# Altium schematic sheet thermocouple_2.SchDoc
size B; Address1: MILWAUKEE TOOL; Address2: 13135 W. Lisbon Rd.; Address3: Brookfield, WI 53005; SheetNumber: 1; SheetTotal: 1
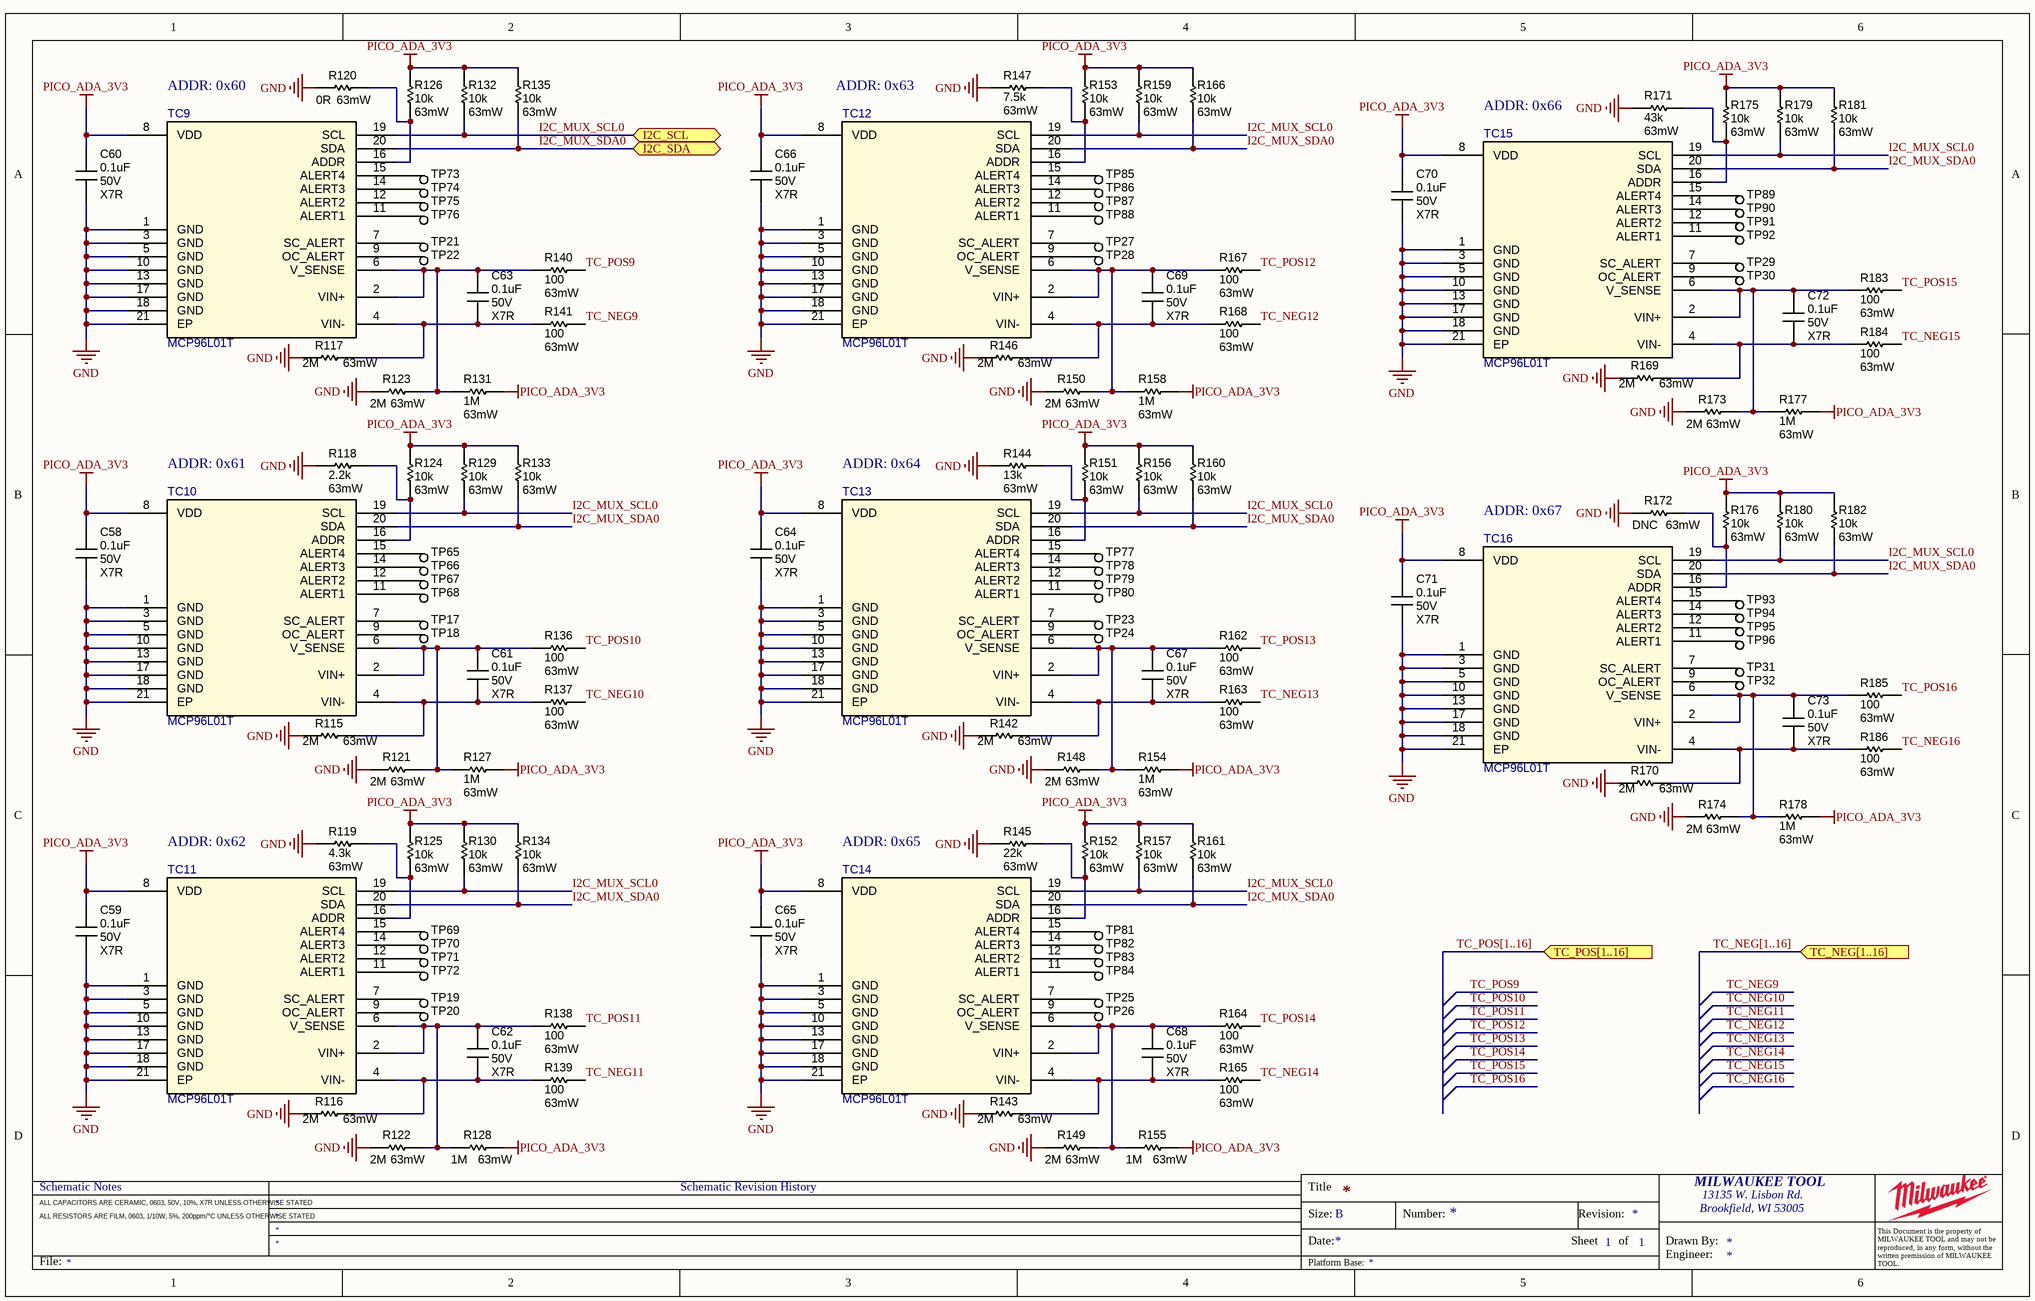
[diagram p0: thermocouple_2.SchDoc]

## Parts
C58  0.1uF  Voltage Rating: 50V  Temp Coeff: X7R  [CAPC1608X09N]
C59  0.1uF  Voltage Rating: 50V  Temp Coeff: X7R  [CAPC1608X09N]
C60  0.1uF  Voltage Rating: 50V  Temp Coeff: X7R  [CAPC1608X09N]
C61  0.1uF  Voltage Rating: 50V  Temp Coeff: X7R  [CAPC1005X06N]
C62  0.1uF  Voltage Rating: 50V  Temp Coeff: X7R  [CAPC1005X06N]
C63  0.1uF  Voltage Rating: 50V  Temp Coeff: X7R  [CAPC1005X06N]
C64  0.1uF  Voltage Rating: 50V  Temp Coeff: X7R  [CAPC1608X09N]
C65  0.1uF  Voltage Rating: 50V  Temp Coeff: X7R  [CAPC1608X09N]
C66  0.1uF  Voltage Rating: 50V  Temp Coeff: X7R  [CAPC1608X09N]
C67  0.1uF  Voltage Rating: 50V  Temp Coeff: X7R  [CAPC1005X06N]
C68  0.1uF  Voltage Rating: 50V  Temp Coeff: X7R  [CAPC1005X06N]
C69  0.1uF  Voltage Rating: 50V  Temp Coeff: X7R  [CAPC1005X06N]
C70  0.1uF  Voltage Rating: 50V  Temp Coeff: X7R  [CAPC1608X09N]
C71  0.1uF  Voltage Rating: 50V  Temp Coeff: X7R  [CAPC1608X09N]
C72  0.1uF  Voltage Rating: 50V  Temp Coeff: X7R  [CAPC1005X06N]
C73  0.1uF  Voltage Rating: 50V  Temp Coeff: X7R  [CAPC1005X06N]
R115  2M  Wattage: 63mW  [RESC1005X04N]
R116  2M  Wattage: 63mW  [RESC1005X04N]
R117  2M  Wattage: 63mW  [RESC1005X04N]
R118  2.2k  Wattage: 63mW  [RESC1005X04N]
R119  4.3k  Wattage: 63mW  [RESC1005X04N]
R120  0R  Wattage: 63mW  [RESC1005X04N]
R121  2M  Wattage: 63mW  [RESC1005X04N]
R122  2M  Wattage: 63mW  [RESC1005X04N]
R123  2M  Wattage: 63mW  [RESC1005X04N]
R124  10k  Wattage: 63mW  [RESC1005X04N]
R125  10k  Wattage: 63mW  [RESC1005X04N]
R126  10k  Wattage: 63mW  [RESC1005X04N]
R127  1M  Wattage: 63mW  [RESC1005X04N]
R128  1M  Wattage: 63mW  [RESC1005X04N]
R129  10k  Wattage: 63mW  [RESC1005X04N]
R130  10k  Wattage: 63mW  [RESC1005X04N]
R131  1M  Wattage: 63mW  [RESC1005X04N]
R132  10k  Wattage: 63mW  [RESC1005X04N]
R133  10k  Wattage: 63mW  [RESC1005X04N]
R134  10k  Wattage: 63mW  [RESC1005X04N]
R135  10k  Wattage: 63mW  [RESC1005X04N]
R136  100  Wattage: 63mW  [RESC1005X04N]
R137  100  Wattage: 63mW  [RESC1005X04N]
R138  100  Wattage: 63mW  [RESC1005X04N]
R139  100  Wattage: 63mW  [RESC1005X04N]
R140  100  Wattage: 63mW  [RESC1005X04N]
R141  100  Wattage: 63mW  [RESC1005X04N]
R142  2M  Wattage: 63mW  [RESC1005X04N]
R143  2M  Wattage: 63mW  [RESC1005X04N]
R144  13k  Wattage: 63mW  [RESC1005X04N]
R145  22k  Wattage: 63mW  [RESC1005X04N]
R146  2M  Wattage: 63mW  [RESC1005X04N]
R147  7.5k  Wattage: 63mW  [RESC1005X04N]
R148  2M  Wattage: 63mW  [RESC1005X04N]
R149  2M  Wattage: 63mW  [RESC1005X04N]
R150  2M  Wattage: 63mW  [RESC1005X04N]
R151  10k  Wattage: 63mW  [RESC1005X04N]
R152  10k  Wattage: 63mW  [RESC1005X04N]
R153  10k  Wattage: 63mW  [RESC1005X04N]
R154  1M  Wattage: 63mW  [RESC1005X04N]
R155  1M  Wattage: 63mW  [RESC1005X04N]
R156  10k  Wattage: 63mW  [RESC1005X04N]
R157  10k  Wattage: 63mW  [RESC1005X04N]
R158  1M  Wattage: 63mW  [RESC1005X04N]
R159  10k  Wattage: 63mW  [RESC1005X04N]
R160  10k  Wattage: 63mW  [RESC1005X04N]
R161  10k  Wattage: 63mW  [RESC1005X04N]
R162  100  Wattage: 63mW  [RESC1005X04N]
R163  100  Wattage: 63mW  [RESC1005X04N]
R164  100  Wattage: 63mW  [RESC1005X04N]
R165  100  Wattage: 63mW  [RESC1005X04N]
R166  10k  Wattage: 63mW  [RESC1005X04N]
R167  100  Wattage: 63mW  [RESC1005X04N]
R168  100  Wattage: 63mW  [RESC1005X04N]
R169  2M  Wattage: 63mW  [RESC1005X04N]
R170  2M  Wattage: 63mW  [RESC1005X04N]
R171  43k  Wattage: 63mW  [RESC1005X04N]
R172  DNC  Wattage: 63mW  [RESC1005X04N]
R173  2M  Wattage: 63mW  [RESC1005X04N]
R174  2M  Wattage: 63mW  [RESC1005X04N]
R175  10k  Wattage: 63mW  [RESC1005X04N]
R176  10k  Wattage: 63mW  [RESC1005X04N]
R177  1M  Wattage: 63mW  [RESC1005X04N]
R178  1M  Wattage: 63mW  [RESC1005X04N]
R179  10k  Wattage: 63mW  [RESC1005X04N]
R180  10k  Wattage: 63mW  [RESC1005X04N]
R181  10k  Wattage: 63mW  [RESC1005X04N]
R182  10k  Wattage: 63mW  [RESC1005X04N]
R183  100  Wattage: 63mW  [RESC1005X04N]
R184  100  Wattage: 63mW  [RESC1005X04N]
R185  100  Wattage: 63mW  [RESC1005X04N]
R186  100  Wattage: 63mW  [RESC1005X04N]
TC9  MCP96L01T  [QFN65P500X500X100_HS-21N]
TC10  MCP96L01T  [QFN65P500X500X100_HS-21N]
TC11  MCP96L01T  [QFN65P500X500X100_HS-21N]
TC12  MCP96L01T  [QFN65P500X500X100_HS-21N]
TC13  MCP96L01T  [QFN65P500X500X100_HS-21N]
TC14  MCP96L01T  [QFN65P500X500X100_HS-21N]
TC15  MCP96L01T  [QFN65P500X500X100_HS-21N]
TC16  MCP96L01T  [QFN65P500X500X100_HS-21N]
TP17  TP_SMT_1MM_CIR  [TP_SMT_1.0MM_CIR]  (value not drawn)  (no BOM)
TP18  TP_SMT_1MM_CIR  [TP_SMT_1.0MM_CIR]  (value not drawn)  (no BOM)
TP19  TP_SMT_1MM_CIR  [TP_SMT_1.0MM_CIR]  (value not drawn)  (no BOM)
TP20  TP_SMT_1MM_CIR  [TP_SMT_1.0MM_CIR]  (value not drawn)  (no BOM)
TP21  TP_SMT_1MM_CIR  [TP_SMT_1.0MM_CIR]  (value not drawn)  (no BOM)
TP22  TP_SMT_1MM_CIR  [TP_SMT_1.0MM_CIR]  (value not drawn)  (no BOM)
TP23  TP_SMT_1MM_CIR  [TP_SMT_1.0MM_CIR]  (value not drawn)  (no BOM)
TP24  TP_SMT_1MM_CIR  [TP_SMT_1.0MM_CIR]  (value not drawn)  (no BOM)
TP25  TP_SMT_1MM_CIR  [TP_SMT_1.0MM_CIR]  (value not drawn)  (no BOM)
TP26  TP_SMT_1MM_CIR  [TP_SMT_1.0MM_CIR]  (value not drawn)  (no BOM)
TP27  TP_SMT_1MM_CIR  [TP_SMT_1.0MM_CIR]  (value not drawn)  (no BOM)
TP28  TP_SMT_1MM_CIR  [TP_SMT_1.0MM_CIR]  (value not drawn)  (no BOM)
TP29  TP_SMT_1MM_CIR  [TP_SMT_1.0MM_CIR]  (value not drawn)  (no BOM)
TP30  TP_SMT_1MM_CIR  [TP_SMT_1.0MM_CIR]  (value not drawn)  (no BOM)
TP31  TP_SMT_1MM_CIR  [TP_SMT_1.0MM_CIR]  (value not drawn)  (no BOM)
TP32  TP_SMT_1MM_CIR  [TP_SMT_1.0MM_CIR]  (value not drawn)  (no BOM)
TP65  TP_SMT_1MM_CIR  [TP_SMT_1.0MM_CIR]  (value not drawn)  (no BOM)
TP66  TP_SMT_1MM_CIR  [TP_SMT_1.0MM_CIR]  (value not drawn)  (no BOM)
TP67  TP_SMT_1MM_CIR  [TP_SMT_1.0MM_CIR]  (value not drawn)  (no BOM)
TP68  TP_SMT_1MM_CIR  [TP_SMT_1.0MM_CIR]  (value not drawn)  (no BOM)
TP69  TP_SMT_1MM_CIR  [TP_SMT_1.0MM_CIR]  (value not drawn)  (no BOM)
TP70  TP_SMT_1MM_CIR  [TP_SMT_1.0MM_CIR]  (value not drawn)  (no BOM)
TP71  TP_SMT_1MM_CIR  [TP_SMT_1.0MM_CIR]  (value not drawn)  (no BOM)
TP72  TP_SMT_1MM_CIR  [TP_SMT_1.0MM_CIR]  (value not drawn)  (no BOM)
TP73  TP_SMT_1MM_CIR  [TP_SMT_1.0MM_CIR]  (value not drawn)  (no BOM)
TP74  TP_SMT_1MM_CIR  [TP_SMT_1.0MM_CIR]  (value not drawn)  (no BOM)
TP75  TP_SMT_1MM_CIR  [TP_SMT_1.0MM_CIR]  (value not drawn)  (no BOM)
TP76  TP_SMT_1MM_CIR  [TP_SMT_1.0MM_CIR]  (value not drawn)  (no BOM)
TP77  TP_SMT_1MM_CIR  [TP_SMT_1.0MM_CIR]  (value not drawn)  (no BOM)
TP78  TP_SMT_1MM_CIR  [TP_SMT_1.0MM_CIR]  (value not drawn)  (no BOM)
TP79  TP_SMT_1MM_CIR  [TP_SMT_1.0MM_CIR]  (value not drawn)  (no BOM)
TP80  TP_SMT_1MM_CIR  [TP_SMT_1.0MM_CIR]  (value not drawn)  (no BOM)
TP81  TP_SMT_1MM_CIR  [TP_SMT_1.0MM_CIR]  (value not drawn)  (no BOM)
TP82  TP_SMT_1MM_CIR  [TP_SMT_1.0MM_CIR]  (value not drawn)  (no BOM)
TP83  TP_SMT_1MM_CIR  [TP_SMT_1.0MM_CIR]  (value not drawn)  (no BOM)
TP84  TP_SMT_1MM_CIR  [TP_SMT_1.0MM_CIR]  (value not drawn)  (no BOM)
TP85  TP_SMT_1MM_CIR  [TP_SMT_1.0MM_CIR]  (value not drawn)  (no BOM)
TP86  TP_SMT_1MM_CIR  [TP_SMT_1.0MM_CIR]  (value not drawn)  (no BOM)
TP87  TP_SMT_1MM_CIR  [TP_SMT_1.0MM_CIR]  (value not drawn)  (no BOM)
TP88  TP_SMT_1MM_CIR  [TP_SMT_1.0MM_CIR]  (value not drawn)  (no BOM)
TP89  TP_SMT_1MM_CIR  [TP_SMT_1.0MM_CIR]  (value not drawn)  (no BOM)
TP90  TP_SMT_1MM_CIR  [TP_SMT_1.0MM_CIR]  (value not drawn)  (no BOM)
TP91  TP_SMT_1MM_CIR  [TP_SMT_1.0MM_CIR]  (value not drawn)  (no BOM)
TP92  TP_SMT_1MM_CIR  [TP_SMT_1.0MM_CIR]  (value not drawn)  (no BOM)
TP93  TP_SMT_1MM_CIR  [TP_SMT_1.0MM_CIR]  (value not drawn)  (no BOM)
TP94  TP_SMT_1MM_CIR  [TP_SMT_1.0MM_CIR]  (value not drawn)  (no BOM)
TP95  TP_SMT_1MM_CIR  [TP_SMT_1.0MM_CIR]  (value not drawn)  (no BOM)
TP96  TP_SMT_1MM_CIR  [TP_SMT_1.0MM_CIR]  (value not drawn)  (no BOM)

## Ports
I2C_SCL (bidir), I2C_SDA (bidir), TC_NEG[1..16] (in), TC_POS[1..16] (in)

## Nets
GND: C58.2 C59.2 C60.2 C64.2 C65.2 C66.2 C70.2 C71.2 R115.1 R116.1 R117.1 R118.1 R119.1 R120.1 R121.1 R122.1 R123.1 R142.1 R143.1 R144.1 R145.1 R146.1 R147.1 R148.1 R149.1 R150.1 R169.1 R170.1 R171.1 R172.1 R173.1 R174.1 TC9.1(GND) TC9.3(GND) TC9.5(GND) TC9.10(GND) TC9.13(GND) TC9.17(GND) TC9.18(GND) TC9.21(EP) TC10.1(GND) TC10.3(GND) TC10.5(GND) TC10.10(GND) TC10.13(GND) TC10.17(GND) TC10.18(GND) TC10.21(EP) TC11.1(GND) TC11.3(GND) TC11.5(GND) TC11.10(GND) TC11.13(GND) TC11.17(GND) TC11.18(GND) TC11.21(EP) TC12.1(GND) TC12.3(GND) TC12.5(GND) TC12.10(GND) TC12.13(GND) TC12.17(GND) TC12.18(GND) TC12.21(EP) TC13.1(GND) TC13.3(GND) TC13.5(GND) TC13.10(GND) TC13.13(GND) TC13.17(GND) TC13.18(GND) TC13.21(EP) TC14.1(GND) TC14.3(GND) TC14.5(GND) TC14.10(GND) TC14.13(GND) TC14.17(GND) TC14.18(GND) TC14.21(EP) TC15.1(GND) TC15.3(GND) TC15.5(GND) TC15.10(GND) TC15.13(GND) TC15.17(GND) TC15.18(GND) TC15.21(EP) TC16.1(GND) TC16.3(GND) TC16.5(GND) TC16.10(GND) TC16.13(GND) TC16.17(GND) TC16.18(GND) TC16.21(EP)
PICO_ADA_3V3: C58.1 C59.1 C60.1 C64.1 C65.1 C66.1 C70.1 C71.1 R124.2 R125.2 R126.2 R127.2 R128.2 R129.2 R130.2 R131.2 R132.2 R133.2 R134.2 R135.2 R151.2 R152.2 R153.2 R154.2 R155.2 R156.2 R157.2 R158.2 R159.2 R160.2 R161.2 R166.2 R175.2 R176.2 R177.2 R178.2 R179.2 R180.2 R181.2 R182.2 TC9.8(VDD) TC10.8(VDD) TC11.8(VDD) TC12.8(VDD) TC13.8(VDD) TC14.8(VDD) TC15.8(VDD) TC16.8(VDD)
I2C_MUX_SCL0: R129.1 R130.1 R132.1 R156.1 R157.1 R159.1 R179.1 R180.1 TC9.19(SCL) TC10.19(SCL) TC11.19(SCL) TC12.19(SCL) TC13.19(SCL) TC14.19(SCL) TC15.19(SCL) TC16.19(SCL) ; port I2C_SCL
I2C_MUX_SDA0: R133.1 R134.1 R135.1 R160.1 R161.1 R166.1 R181.1 R182.1 TC9.20(SDA) TC10.20(SDA) TC11.20(SDA) TC12.20(SDA) TC13.20(SDA) TC14.20(SDA) TC15.20(SDA) TC16.20(SDA) ; port I2C_SDA
TC_NEG9: R141.2
TC_NEG10: R137.2
TC_NEG11: R139.2
TC_NEG12: R168.2
TC_NEG13: R163.2
TC_NEG14: R165.2
TC_NEG15: R184.2
TC_NEG16: R186.2
TC_POS9: R140.2
TC_POS10: R136.2
TC_POS11: R138.2
TC_POS12: R167.2
TC_POS13: R162.2
TC_POS14: R164.2
TC_POS15: R183.2
TC_POS16: R185.2
NetC61_1: C61.1 R121.2 R127.1 R136.1 TC10.2(VIN+) TC10.6(V_SENSE)
NetC61_2: C61.2 R115.2 R137.1 TC10.4(VIN-)
NetC62_1: C62.1 R122.2 R128.1 R138.1 TC11.2(VIN+) TC11.6(V_SENSE)
NetC62_2: C62.2 R116.2 R139.1 TC11.4(VIN-)
NetC63_1: C63.1 R123.2 R131.1 R140.1 TC9.2(VIN+) TC9.6(V_SENSE)
NetC63_2: C63.2 R117.2 R141.1 TC9.4(VIN-)
NetC67_1: C67.1 R148.2 R154.1 R162.1 TC13.2(VIN+) TC13.6(V_SENSE)
NetC67_2: C67.2 R142.2 R163.1 TC13.4(VIN-)
NetC68_1: C68.1 R149.2 R155.1 R164.1 TC14.2(VIN+) TC14.6(V_SENSE)
NetC68_2: C68.2 R143.2 R165.1 TC14.4(VIN-)
NetC69_1: C69.1 R150.2 R158.1 R167.1 TC12.2(VIN+) TC12.6(V_SENSE)
NetC69_2: C69.2 R146.2 R168.1 TC12.4(VIN-)
NetC72_1: C72.1 R173.2 R177.1 R183.1 TC15.2(VIN+) TC15.6(V_SENSE)
NetC72_2: C72.2 R169.2 R184.1 TC15.4(VIN-)
NetC73_1: C73.1 R174.2 R178.1 R185.1 TC16.2(VIN+) TC16.6(V_SENSE)
NetC73_2: C73.2 R170.2 R186.1 TC16.4(VIN-)
NetR118_2: R118.2 R124.1 TC10.16(ADDR)
NetR119_2: R119.2 R125.1 TC11.16(ADDR)
NetR120_2: R120.2 R126.1 TC9.16(ADDR)
NetR144_2: R144.2 R151.1 TC13.16(ADDR)
NetR145_2: R145.2 R152.1 TC14.16(ADDR)
NetR147_2: R147.2 R153.1 TC12.16(ADDR)
NetR171_2: R171.2 R175.1 TC15.16(ADDR)
NetR172_2: R172.2 R176.1 TC16.16(ADDR)
NetTC9_7: TC9.7(SC_ALERT) TP21.1
NetTC9_9: TC9.9(OC_ALERT) TP22.1
NetTC9_11: TC9.11(ALERT1) TP76.1
NetTC9_12: TC9.12(ALERT2) TP75.1
NetTC9_14: TC9.14(ALERT3) TP74.1
NetTC9_15: TC9.15(ALERT4) TP73.1
NetTC10_7: TC10.7(SC_ALERT) TP17.1
NetTC10_9: TC10.9(OC_ALERT) TP18.1
NetTC10_11: TC10.11(ALERT1) TP68.1
NetTC10_12: TC10.12(ALERT2) TP67.1
NetTC10_14: TC10.14(ALERT3) TP66.1
NetTC10_15: TC10.15(ALERT4) TP65.1
NetTC11_7: TC11.7(SC_ALERT) TP19.1
NetTC11_9: TC11.9(OC_ALERT) TP20.1
NetTC11_11: TC11.11(ALERT1) TP72.1
NetTC11_12: TC11.12(ALERT2) TP71.1
NetTC11_14: TC11.14(ALERT3) TP70.1
NetTC11_15: TC11.15(ALERT4) TP69.1
NetTC12_7: TC12.7(SC_ALERT) TP27.1
NetTC12_9: TC12.9(OC_ALERT) TP28.1
NetTC12_11: TC12.11(ALERT1) TP88.1
NetTC12_12: TC12.12(ALERT2) TP87.1
NetTC12_14: TC12.14(ALERT3) TP86.1
NetTC12_15: TC12.15(ALERT4) TP85.1
NetTC13_7: TC13.7(SC_ALERT) TP23.1
NetTC13_9: TC13.9(OC_ALERT) TP24.1
NetTC13_11: TC13.11(ALERT1) TP80.1
NetTC13_12: TC13.12(ALERT2) TP79.1
NetTC13_14: TC13.14(ALERT3) TP78.1
NetTC13_15: TC13.15(ALERT4) TP77.1
NetTC14_7: TC14.7(SC_ALERT) TP25.1
NetTC14_9: TC14.9(OC_ALERT) TP26.1
NetTC14_11: TC14.11(ALERT1) TP84.1
NetTC14_12: TC14.12(ALERT2) TP83.1
NetTC14_14: TC14.14(ALERT3) TP82.1
NetTC14_15: TC14.15(ALERT4) TP81.1
NetTC15_7: TC15.7(SC_ALERT) TP29.1
NetTC15_9: TC15.9(OC_ALERT) TP30.1
NetTC15_11: TC15.11(ALERT1) TP92.1
NetTC15_12: TC15.12(ALERT2) TP91.1
NetTC15_14: TC15.14(ALERT3) TP90.1
NetTC15_15: TC15.15(ALERT4) TP89.1
NetTC16_7: TC16.7(SC_ALERT) TP31.1
NetTC16_9: TC16.9(OC_ALERT) TP32.1
NetTC16_11: TC16.11(ALERT1) TP96.1
NetTC16_12: TC16.12(ALERT2) TP95.1
NetTC16_14: TC16.14(ALERT3) TP94.1
NetTC16_15: TC16.15(ALERT4) TP93.1

## Buses and harness runs
bus TC_NEG[1..16] = port TC_NEG[1..16]
bus TC_POS[1..16] = port TC_POS[1..16]

## Notes on the sheet
- (near TC9) ADDR: 0x60
- (near TC12) ADDR: 0x63
- (near TC15) ADDR: 0x66
- (near TC10) ADDR: 0x61
- (near TC13) ADDR: 0x64
- (near TC16) ADDR: 0x67
- (near TC11) ADDR: 0x62
- (near TC14) ADDR: 0x65
- Schematic Notes
- Schematic Revision History
- Title
- ALL CAPACITORS ARE CERAMIC, 0603, 50V, 10%, X7R UNLESS OTHERWISE STATED
- ALL RESISTORS ARE FILM, 0603, 1/10W, 5%, 200ppm/°C UNLESS OTHERWISE STATED
- Size:
- Date:
- B
- Number:
- Sheet
- Revision:
- of
- Drawn By:
- Brookfield, WI 53005
- File:
- Platform Base:
- Engineer:
- This Document is the property of MILWAUKEE TOOL and may not be reproduced, in any form, without the written premission of MILWAUKEE TOOL.

## Library data of the parts
C58-C60 C64-C66 C70 C71 = CMP-004-0070: CAP CER 0.1UF 50V X7R 0603; MFR#: C0603C104K5RACTU; MFR: KEMET; MFR2#: CC0603KRX7R9BB104; Tolerance: 10%; Temp Range: -55 / +125 C; Capacitor Type: Ceramic; Case Code (Imperial): 0608; Value: 0.1uF; Design Item ID: CN/0.1uF/50V/X7R/10%/0603; Case Code (Metric): 1608; ComponentLink1URL: https://product.tdk.com/info/en/catalog/datasheets/mlcc_automotive_midvoltage_en.pdf?ref_disty=digikey; MFR2: Yageo; ComponentLink1Description: Datasheet; Part Status: Production; Lead Free: *
C61-C63 C67-C69 C72 C73 = CMP-004-0076: CAP CER SMD 0.1UF 50V X7R 0402; MFR3#: KGM05CR71H104KH; MFR#: GRM155R71H104KE14D; MFR: Murata Electronics; MFR4#: CL05B104KB54PNC; MFR2#: C1005X7R1H104K050BB; Tolerance: 10%; Populate: Yes; Temp Range: -55 / +125 C; Capacitor Type: Ceramic; Case Code (Imperial): 0402; Value: 0.1uF; MFR4: Samsung Electro-Mechanics; Design Item ID: CN/0.1uF/50V/X7R/10%/0402; Case Code (Metric): 1005; ComponentLink1URL: https://search.murata.co.jp/Ceramy/image/img/A01X/G101/ENG/GRM155R71H104KE14-01.pdf; MFR3: KYOCERA AVX; MFR2: TDK Corporation; ComponentLink1Description: Datasheet; RoHS Compliant: Yes; Part Status: Production
R115-R117 R121-R123 R142 R143 R146 R148-R150 R169 R170 R173 R174 = CMP-025-0172: RES SMD 2M OHM 1% 1/16W 0402; MFR#: RC0402FR-072ML; MFR: YAGEO; Value: 2M Ohm; Temp Range: -55 / +155 C; Temperature Coefficient: 100ppm/°C; Populate: Yes; Tolerance: 1%; ComponentLink1Description: Datasheet; ComponentLink1URL: https://yageogroup.com/content/datasheet/asset/file/PYU-RC_GROUP_51_ROHS_L; Resistor Type: Thick Film; Case Code (Imperial): 0402; Case Code (Metric): 1005; Design Item ID: R/2.0M/0.063W/1%/0402; RoHS Compliant: Yes; Part Status: Production
R118 = CMP-025-0171: RES SMD 2.2K OHM 1% 1/16W 0402; MFR#: RC0402FR-072K2L; MFR: YAGEO; Voltage Rating: 250V; Temp Range: -55 / +155 C; Current: 6A; Temperature Coefficient: 100ppm/°C; Populate: Yes; Value: 2.2k Ohm; Tolerance: 1%; ComponentLink1Description: Datasheet; ComponentLink1URL: https://yageogroup.com/content/datasheet/asset/file/PYU-RC_GROUP_51_ROHS_L; Resistor Type: Thick Film; Case Code (Imperial): 0402; Case Code (Metric): 3216; Design Item ID: R/2.2K/0.063W/1%/0402; RoHS Compliant: Yes; Part Status: Production
R119 = CMP-025-0176: RES SMD 4.3K OHM 1% 1/16W 0402; MFR#: RC0402FR-074K3L; MFR: Yageo; Temp Range: -55 / +155 C; Temperature Coefficient: 50 ppm/°C; Populate: Yes; Value: 4.3k Ohm; Tolerance: 1%; ComponentLink1Description: Datasheet; ComponentLink1URL: https://yageogroup.com/content/datasheet/asset/file/PYU-RC_GROUP_51_ROHS_L; Resistor Type: Thick Film; Case Code (Imperial): 0402; Case Code (Metric): 1005; Design Item ID: R/4.3K/0.063W/1%/0402; RoHS Compliant: Yes; Part Status: Production
R120 R172 = CMP-025-0102: RES SMD 0 OHM JUMPER 1/16W 0402; MFR3#: CRCW04020000Z0ED; MFR: Stackpole Electronics Inc; MFR2#: AC0402JR-070RL; MFR4#: RS-02K000JT; MFR#: RMCF0402ZT0R00; Value: 0 ohm; Quality: AEC-Q200; Voltage Rating: 50V; Current: 1A; Temp Range: -55 / +155 C; Case Code (Metric): 1002; Case Code (Imperial): 0402; MFR2: YAGEO; Design Item ID: R/0.00/0.063W/JUMPER/0402; MFR4: FengHua; Resistor Type: Thick Film; ClassName: Fine_Pitch; MFR3: Vishay Dale; Tolerance: Jumper; REACH SVHC: Yes; RoHS Compliant: Yes
R124-R126 R129 R130 R132-R135 R151-R153 R156 R157 R159-R161 R166 R175 R176 R179-R182 = CMP-025-0026: RES SMD 10K OHM 0.5% 1/16W 0402; MFR2#: RNCF0402DTE10K0; MFR#: ERA-2AED103X; MFR: Panasonic Electronic Components; Temp Range: -55 / +155 C; Voltage Rating: 50V; Temperature Coefficient: 25ppm/°C; Quality: AEC-Q200; MFR2: Stackpole Electronics Inc; RoHS Compliant: Yes; ComponentLink1Description: Datasheet; REACH SVHC: Yes; Value: 10k; Case Code (Imperial): 0402; Case Code (Metric): 1005; Tolerance: 0.5%; Resistor Type: Thick Film; Design Item ID: R/10.0K/0.063W/0.5%/0402; ComponentLink1URL: https://industrial.panasonic.com/cdbs/www-data/pdf/RDM0000/AOA0000C307.pdf
R127 R128 R131 R154 R155 R158 R177 R178 = CMP-025-0173: RES SMD 1M OHM 1% 1/16W 0402; MFR#: RC0402FR-071ML; MFR: YAGEO; Value: 1M Ohm; Temp Range: -55 / +155 C; Temperature Coefficient: 100ppm/°C; Populate: Yes; Tolerance: 1%; ComponentLink1Description: Datasheet; ComponentLink1URL: https://yageogroup.com/content/datasheet/asset/file/PYU-RC_GROUP_51_ROHS_L; Resistor Type: Thick Film; Case Code (Imperial): 0402; Case Code (Metric): 1005; Design Item ID: R/1.0M/0.063W/1%/0402; RoHS Compliant: Yes; Part Status: Production
R136-R141 R162-R165 R167 R168 R183-R186 = CMP-025-0156: RES SMD 100 OHM 1% 1/16W 0402; MFR4#: CR0402-FX-1000GLF; MFR#: RMCF0402FT100R; MFR: Stackpole Electronics Inc; MFR3#: CRCW0402100RFKED; MFR2#: RC0402FR-07100RL; Value: 100 Ohm; Voltage Rating: 75V; Temp Range: -55 / +155 C; Current: 1A; Temperature Coefficient: 100ppm/°C; Populate: Yes; MFR2: YAGEO; Tolerance: 1%; MFR3: Vishay Dale; ComponentLink1Description: Datasheet; ComponentLink1URL: https://www.yageo.com/upload/media/product/products/datasheet/rchip/PYu-RC_Group_51_RoHS_L_12.pdf; Resistor Type: Thick Film; Case Code (Imperial): 0402; MFR4: Bourns Inc; Case Code (Metric): 1005; Design Item ID: R/100.0/0.063W/1%/0402; RoHS Compliant: Yes
R144 = CMP-025-0178: RES SMD 13K OHM 1% 1/16W 0402; MFR#: RC0402FR-0713KL; MFR: Yageo; Value: 13k Ohm; Temp Range: -55 / +155 C; Temperature Coefficient: 50 ppm/°C; Populate: Yes; Tolerance: 1%; ComponentLink1Description: Datasheet; ComponentLink1URL: https://yageogroup.com/content/datasheet/asset/file/PYU-RC_GROUP_51_ROHS_L; Resistor Type: Thick Film; Case Code (Imperial): 0402; Case Code (Metric): 1005; Design Item ID: R/13K/0.063W/1%/0402; RoHS Compliant: Yes; Part Status: Production
R145 = CMP-025-0179: RES SMD 22K OHM 1% 1/16W 0402; MFR#: RC0402FR-0722KL; MFR: Yageo; Value: 22k Ohm; Temp Range: -55 / +155 C; Temperature Coefficient: 50 ppm/°C; Populate: Yes; Tolerance: 1%; ComponentLink1Description: Datasheet; ComponentLink1URL: https://yageogroup.com/content/datasheet/asset/file/PYU-RC_GROUP_51_ROHS_L; Resistor Type: Thick Film; Case Code (Imperial): 0402; Case Code (Metric): 1005; Design Item ID: R/22K/0.063W/1%/0402; RoHS Compliant: Yes; Part Status: Production
R147 = CMP-025-0177: RES SMD 7.5K OHM 1% 1/16W 0402; MFR#: RC0402FR-077K5L; MFR: Yageo; Temp Range: -55 / +155 C; Temperature Coefficient: 50 ppm/°C; Populate: Yes; Value: 7.5k Ohm; Tolerance: 1%; ComponentLink1Description: Datasheet; ComponentLink1URL: https://yageogroup.com/content/datasheet/asset/file/PYU-RC_GROUP_51_ROHS_L; Resistor Type: Thick Film; Case Code (Imperial): 0402; Case Code (Metric): 1005; Design Item ID: R/7.5K/0.063W/1%/0402; RoHS Compliant: Yes; Part Status: Production
R171 = CMP-025-0180: RES SMD 43K OHM 1% 1/16W 0402; MFR#: RC0402FR-0743KL; MFR: Yageo; Value: 43k Ohm; Temp Range: -55 / +155 C; Temperature Coefficient: 50 ppm/°C; Populate: Yes; Tolerance: 1%; ComponentLink1Description: Datasheet; ComponentLink1URL: https://yageogroup.com/content/datasheet/asset/file/PYU-RC_GROUP_51_ROHS_L; Resistor Type: Thick Film; Case Code (Imperial): 0402; Case Code (Metric): 1005; Design Item ID: R/43K/0.063W/1%/0402; RoHS Compliant: Yes; Part Status: Production
TC9-TC16 = CMP-017-0115: IC THERMOCOUPLE AMPLIFIER I2C; MFR: Microchip; Value: MCP96L01T-E/MX; Populate: Yes; REACFH SVCH: Unaffected; Temp Range, Ambient: -40 / +125 C; Voltage Range: 2.3V / +5.5 V; Temp Range, Junction: -40 / +150C; MFR#: MCP96L01T-E/MX; Case Package: QFN-21N; Design Item ID: IC/TC/MCP96L01/QFN20; Part Status: Production; RoHS Comliant: Yes; Type: THERMOCOUPLE; ComponentLink1Description: Datasheet; ComponentLink1URL: https://ww1.microchip.com/downloads/en/DeviceDoc/MCP960X-L0X-RL0X-Data-Sheet-20005426F.pdf
TP17-TP32 TP65-TP96 = CMP-019-0006: TP SMT 1mm Circle; Value: TP_1mm; Populate: DNP; ClassName: Test Point; Design Item ID: TP_SMT_1MM_CIR; Shape/Size: 1mm Circle